# Altium schematic sheet control_loop.SchDoc
size A
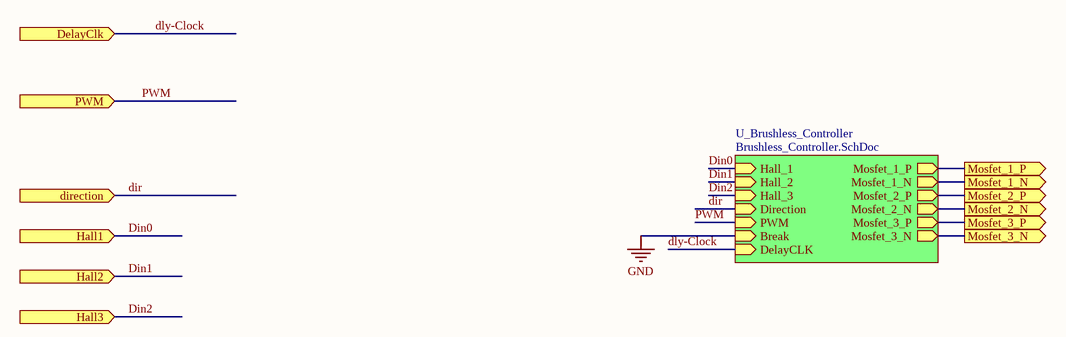
[diagram p0: control_loop.SchDoc]

## Sub-sheets
U_Brushless_Controller = Brushless_Controller.SchDoc: Hall_1 (in), Hall_2 (in), Hall_3 (in), Direction (in), PWM (in), Mosfet_1_P (out), Mosfet_1_N (out), Mosfet_2_P (out), Mosfet_2_N (out), Mosfet_3_P (out), Mosfet_3_N (out), Break (in), DelayCLK (in)

## Ports
DelayClk (in), direction (in), Hall1 (in), Hall2 (in), Hall3 (in), Mosfet_1_N (out), Mosfet_1_P (out), Mosfet_2_N (out), Mosfet_2_P (out), Mosfet_3_N (out), Mosfet_3_P (out), PWM (in)

## Nets
GND: sheet U_Brushless_Controller/Break
Din0: port Hall1, sheet U_Brushless_Controller/Hall_1
Din1: port Hall2, sheet U_Brushless_Controller/Hall_2
Din2: port Hall3, sheet U_Brushless_Controller/Hall_3
dir: port direction, sheet U_Brushless_Controller/Direction
dly-Clock: port DelayClk, sheet U_Brushless_Controller/DelayCLK
Mosfet_1_N: port Mosfet_1_N, sheet U_Brushless_Controller/Mosfet_1_N
Mosfet_1_P: port Mosfet_1_P, sheet U_Brushless_Controller/Mosfet_1_P
Mosfet_2_N: port Mosfet_2_N, sheet U_Brushless_Controller/Mosfet_2_N
Mosfet_2_P: port Mosfet_2_P, sheet U_Brushless_Controller/Mosfet_2_P
Mosfet_3_N: port Mosfet_3_N, sheet U_Brushless_Controller/Mosfet_3_N
Mosfet_3_P: port Mosfet_3_P, sheet U_Brushless_Controller/Mosfet_3_P
PWM: port PWM, sheet U_Brushless_Controller/PWM